# EAGLE design Group_06 (EAGLE 9.6.2)

## Sheet 1 of 2
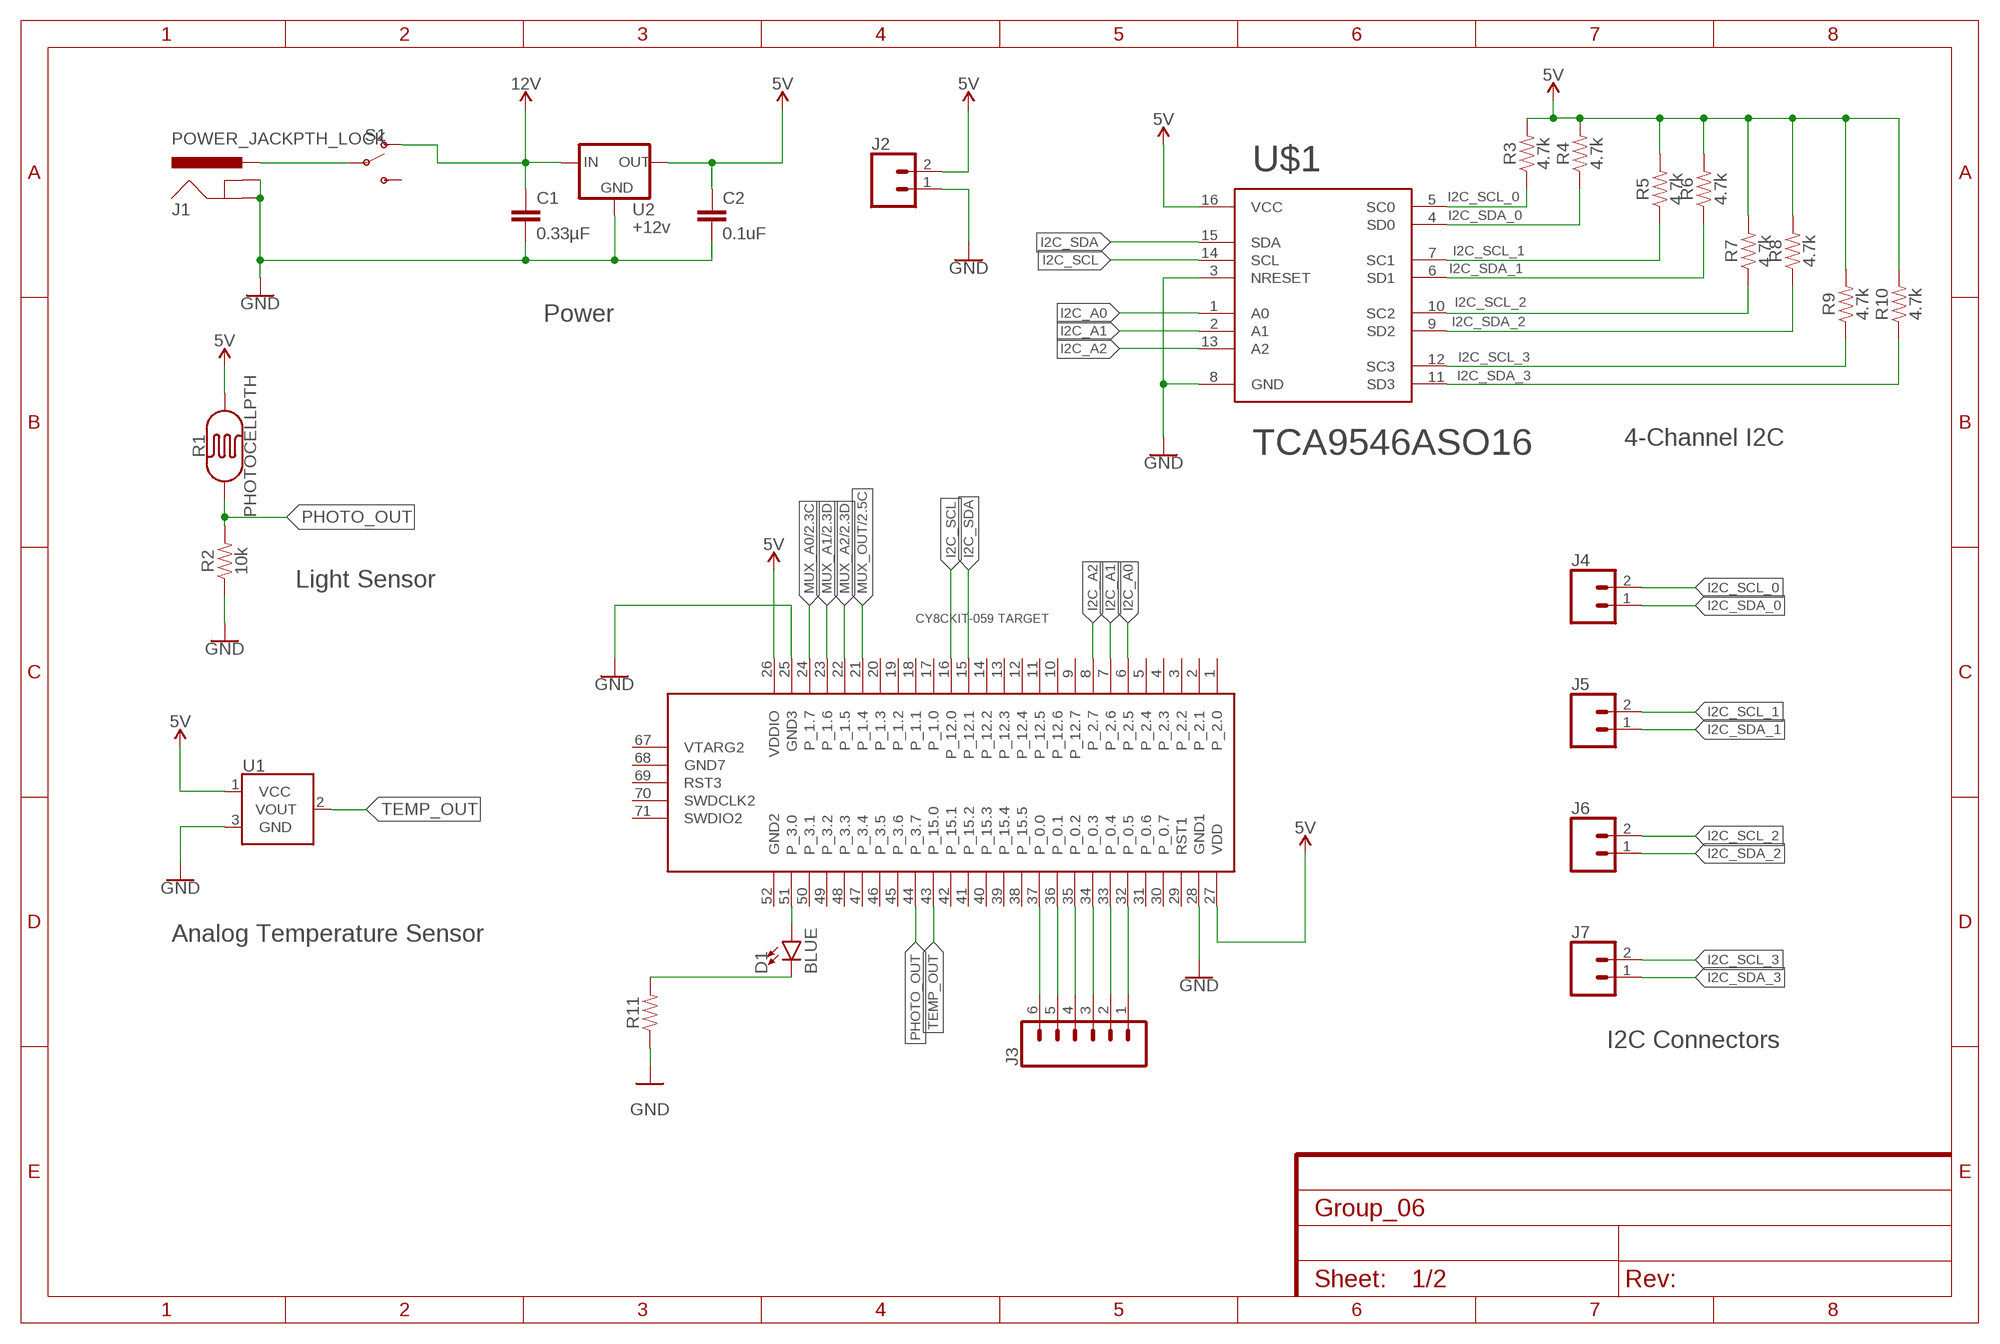
[diagram p0: schematic, sheet 1]

### Parts
C1  0.33µF  0.33UF/330NF-0805-50V-10%  [0805]
C2  0.1uF  0.1UF-KIT-EZ-50V-20%  [CAP-PTH-SMALL-KIT]
D1  BLUE  LED-BLUE1206  [LED-1206]
J1  POWER_JACKPTH_LOCK  [POWER_JACK_PTH_LOCK]
J2  CONN_02  [1X02]
J3  CONN_06LOCK  [1X06_LOCK]
J4  CONN_02  [1X02]
J5  CONN_02  [1X02]
J6  CONN_02  [1X02]
J7  CONN_02  [1X02]
R1  PHOTOCELLPTH  [PHOTOCELL]
R2  10k  10KOHM-0603-1/10W-1%  [0603]
R3  4.7k  4.7KOHM-0603-1/10W-1%  [0603]
R4  4.7k  4.7KOHM-0603-1/10W-1%  [0603]
R5  4.7k  4.7KOHM-0603-1/10W-1%  [0603]
R6  4.7k  4.7KOHM-0603-1/10W-1%  [0603]
R7  4.7k  4.7KOHM-0603-1/10W-1%  [0603]
R8  4.7k  4.7KOHM-0603-1/10W-1%  [0603]
R9  4.7k  4.7KOHM-0603-1/10W-1%  [0603]
R10  4.7k  4.7KOHM-0603-1/10W-1%  [0603]
R11  RESISTORAXIAL-0.3  [AXIAL-0.3]
S1  SWITCH-SPDT-PTH-11.6X4.0MM  [SWITCH_SPDT_PTH_11.6X4.0MM]
U1  TMP36GT9  [TO-92]
U2  +12v  V_REG_78XX7812  [TO-252]
U$1  TCA9546ASO16  [TSSOP-16]
U$2  CY8CKIT-059_TARGET  [CY8CKIT-059_TARGET]

### Nets
5V: C2.1 J2.2 R1.2 R3.2 R4.2 R5.2 R6.2 R7.2 R8.2 R9.2 R10.2 U1.1(VCC) U2.2(OUT) U$1.16(VCC) U$2.26(VDDIO) U$2.27(VDD) ; also sheet 2
12V: C1.1 S1.1(O) U2.1(IN)
GND: C1.2 C2.2 J1.GND J1.GNDBREAK J2.1 R2.1 R11.P$1 U1.3(GND) U2.3(GND) U$1.3(NRESET) U$1.8(GND) U$2.25(GND3) U$2.28(GND1) ; also sheet 2
I2C_A0: U$1.1(A0) U$2.6(P_2.5)
I2C_A1: U$1.2(A1) U$2.7(P_2.6)
I2C_A2: U$1.13(A2) U$2.8(P_2.7)
I2C_SCL: U$1.14(SCL) U$2.16(P_12.0)
I2C_SCL_0: J4.2 R3.1 U$1.5(SC0)
I2C_SCL_1: J5.2 R5.1 U$1.7(SC1)
I2C_SCL_2: J6.2 R7.1 U$1.10(SC2)
I2C_SCL_3: J7.2 R9.1 U$1.12(SC3)
I2C_SDA: U$1.15(SDA) U$2.15(P_12.1)
I2C_SDA_0: J4.1 R4.1 U$1.4(SD0)
I2C_SDA_1: J5.1 R6.1 U$1.6(SD1)
I2C_SDA_2: J6.1 R8.1 U$1.9(SD2)
I2C_SDA_3: J7.1 R10.1 U$1.11(SD3)
MUX_A0: U$2.24(P_1.7) ; also sheet 2
MUX_A1: U$2.23(P_1.6) ; also sheet 2
MUX_A2: U$2.22(P_1.5) ; also sheet 2
MUX_OUT: U$2.21(P_1.4) ; also sheet 2
N$1: J1.PWR S1.2(P)
N$3: D1.A U$2.51(P_3.0)
N$4: D1.C R11.P$2
N$5: J3.6 U$2.37(P_0.0)
N$6: J3.5 U$2.36(P_0.1)
N$7: J3.4 U$2.35(P_0.2)
N$8: J3.3 U$2.34(P_0.3)
N$9: J3.2 U$2.33(P_0.4)
N$18: J3.1 U$2.32(P_0.5)
PHOTO_OUT: R1.1 R2.2 U$2.44(P_3.7)
TEMP_OUT: U1.2(VOUT) U$2.43(P_15.0)
Unconnected: S1.3(S) U$2.1(P_2.0) U$2.2(P_2.1) U$2.3(P_2.2) U$2.4(P_2.3) U$2.5(P_2.4) U$2.9(P_12.7) U$2.10(P_12.6) U$2.11(P_12.5) U$2.12(P_12.4) U$2.13(P_12.3) U$2.14(P_12.2) U$2.17(P_1.0) U$2.18(P_1.1) U$2.19(P_1.2) U$2.20(P_1.3) U$2.29(RST1) U$2.30(P_0.7) U$2.31(P_0.6) U$2.38(P_15.5) U$2.39(P_15.4) U$2.40(P_15.3) U$2.41(P_15.2) U$2.42(P_15.1) U$2.45(P_3.6) U$2.46(P_3.5) U$2.47(P_3.4) U$2.48(P_3.3) U$2.49(P_3.2) U$2.50(P_3.1) U$2.52(GND2) U$2.67(VTARG2) U$2.68(GND7) U$2.69(RST3) U$2.70(SWDCLK2) U$2.71(SWDIO2)

### Notes on the sheet
- Power
- 4-Channel I2C
- Light Sensor
- Analog Temperature Sensor
- I2C Connectors

## Sheet 2 of 2
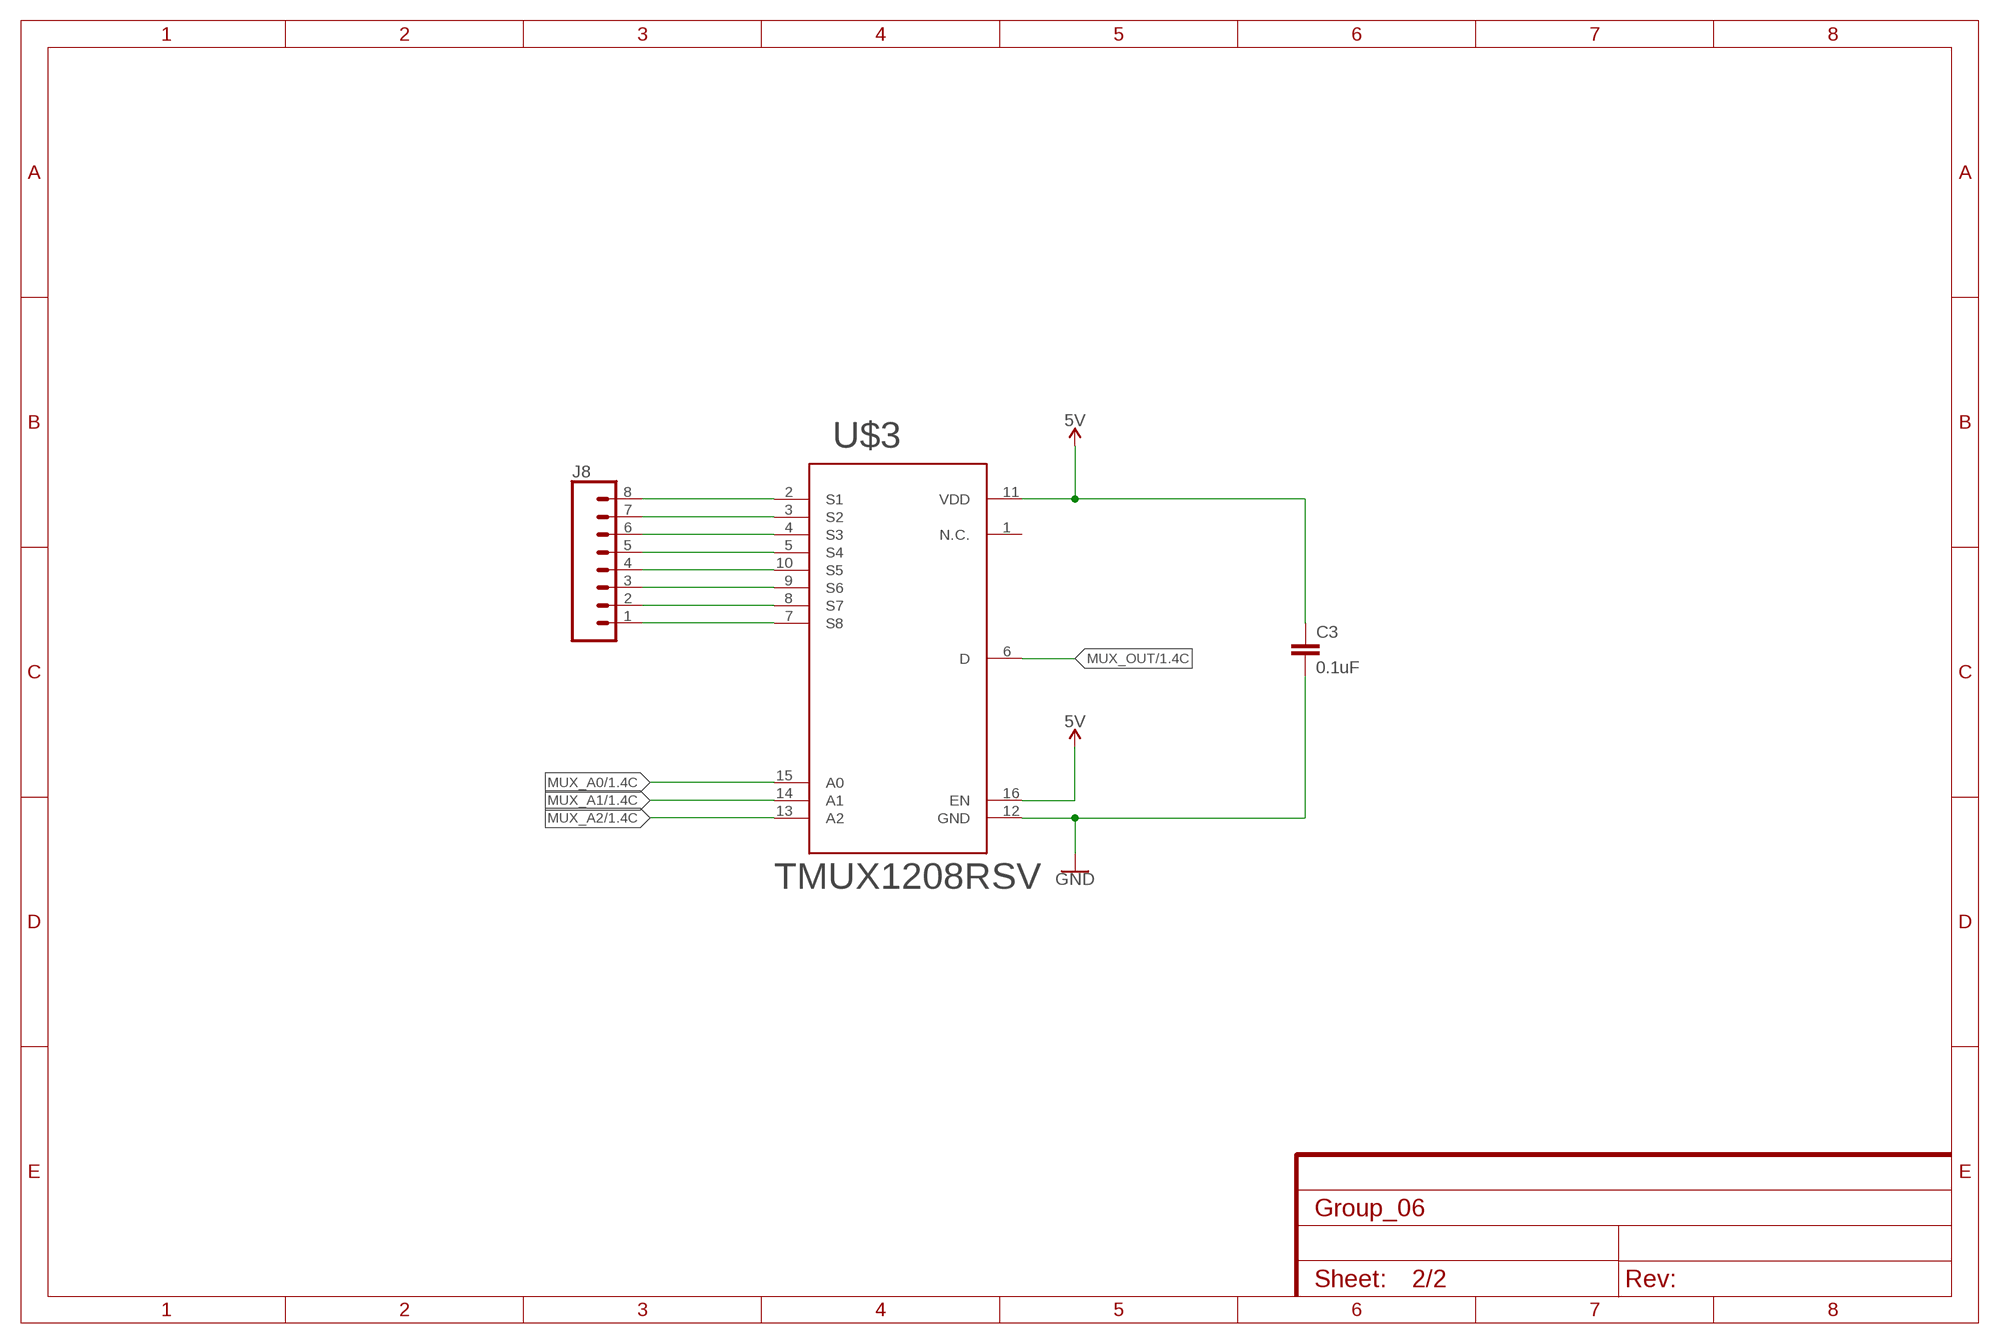
[diagram p1: schematic, sheet 2]

### Parts
C3  0.1uF  0.1UF-KIT-EZ-50V-20%  [CAP-PTH-SMALL-KIT]
J8  CONN_08LOCK  [1X08_LOCK]
U$3  TMUX1208RSV  [QFN-16]

### Nets
5V: C3.1 U$3.11(VDD) U$3.16(EN) ; also sheet 1
GND: C3.2 U$3.12(GND) ; also sheet 1
MUX_A0: U$3.15(A0) ; also sheet 1
MUX_A1: U$3.14(A1) ; also sheet 1
MUX_A2: U$3.13(A2) ; also sheet 1
MUX_OUT: U$3.6(D) ; also sheet 1
N$2: J8.8 U$3.2(S1)
N$10: J8.7 U$3.3(S2)
N$11: J8.6 U$3.4(S3)
N$12: J8.5 U$3.5(S4)
N$13: J8.4 U$3.10(S5)
N$14: J8.3 U$3.9(S6)
N$15: J8.2 U$3.8(S7)
N$16: J8.1 U$3.7(S8)
Unconnected: U$3.1(N.C.)

## Library data of the parts
C1 = SparkFun-Capacitors:0.33UF/330NF: 0.33µF/330nF ceramic capacitors A capacitor is a passive two-terminal electrical component used to store electrical energy temporarily in an electric field.; PROD_ID: CAP-08469
C2 C3 = SparkFun-Capacitors:0.1UF: 0.1µF ceramic capacitors A capacitor is a passive two-terminal electrical component used to store electrical energy temporarily in an electric field.; PROD_ID: CAP-08370
D1 = SparkFun-LED:LED-BLUE: Blue SMD LED Used in manufacturing of various products at SparkFun Packages: 0603 - SMD 0603 package [Product Link] <http://www.digikey.com/product-detail/en/SMLE12BC7TT86/511-1589-2-ND/1641808> 1206 - SMD1206 package [Product Link] <http://www.digikey.com/product-detail/en/lite-on-inc/LTST-C150TBKT/160-1643-1-ND/573584> SparkFun Products: ESP8266 Thing-Dev Board <https://www.sparkfun.com/products/13711> RedBoard <https://www.sparkfun.com/products/12757>; PROD_ID: DIO-09911
J1 = SparkFun-Connectors:POWER_JACK: Power Jack Connector This is the standard 5.5mm barrel jack for power. The PTH is the most common, proven, reliable, footprint. The Slot footprint only works if the mill layer is transmitted to the PCB fab house so be warned. Here are the connectors we sell at SparkFun: DC Barrel Power Jack/Connector <https://www.sparkfun.com/products/119> (PRT-00119) DC Barrel Power Jack/Connector (SMD) <https://www.sparkfun.com/products/12748> (PRT-12748) DC Barrel Jack Adapter - Breadboard Compatible <https://www.sparkfun.com/products/10811> (PRT-10811) It is used on this SparkFun product (and many, many others): SparkFun RedBoard - Programmed with Arduino <https://www.sparkfun.com/products/12757> (DEV-12757) Also, if you need a mating power supply or connector, please check these out: Wall Adapter Power Supply - 9VDC 650mA <https://www.sparkfun.com/products/298> (TOL-00298) DC Barrel Jack Adapter - Male <https://www.sparkfun.com/products/10287> (PRT-10287); PROD_ID: CONN-08197; SF_ID: PRT-00119
J2 J4-J7 = SparkFun-Connectors:CONN_02: Multi connection point. Often used as Generic Header-pin footprint for 0.1 inch spaced/style header connections On any of the 0.1 inch spaced packages, you can populate with these: Break Away Headers - Straight <https://www.sparkfun.com/products/116> (PRT-00116) Break Away Male Headers - Right Angle <https://www.sparkfun.com/products/553> (PRT-00553) Female Headers <https://www.sparkfun.com/products/115> (PRT-00115) Break Away Headers - Machine Pin <https://www.sparkfun.com/products/117> (PRT-00117) Break Away Female Headers - Swiss Machine Pin <https://www.sparkfun.com/products/743> (PRT-00743) For SCREWTERMINALS and SPRING TERMINALS visit here: Screw Terimnals on SparkFun.com <https://www.sparkfun.com/search/results?term=Screw+Terminals> (5mm/3.5mm/2.54mm spacing) This device is also useful as a general connection point to wire up your design to another part of your project. Our various solder wires solder well into these plated through hole pads. Hook-Up Wire - Assortment (Stranded, 22 AWG) <https://www.sparkfun.com/products/11375> (PRT-11375) Hook-Up Wire - Assortment (Solid Core, 22 AWG) <https://www.sparkfun.com/products/11367> (PRT-11367) View the entire wire category on our website here <https://www.sparkfun.com/categories/141> Special notes: Molex polarized connector foot print use with: PRT-08233 with associated crimp pins and housings. 2.54_SCREWTERM for use with PRT-10571. 3.5mm Screw Terminal footprints for PRT-08084 5mm Screw Terminal footprints for use with PRT-08432
J3 = SparkFun-Connectors:CONN_06: Multi connection point. Often used as Generic Header-pin footprint for 0.1 inch spaced/style header connections On any of the 0.1 inch spaced packages, you can populate with these: Break Away Headers - Straight <https://www.sparkfun.com/products/116> (PRT-00116) Break Away Male Headers - Right Angle <https://www.sparkfun.com/products/553> (PRT-00553) Female Headers <https://www.sparkfun.com/products/115> (PRT-00115) Break Away Headers - Machine Pin <https://www.sparkfun.com/products/117> (PRT-00117) Break Away Female Headers - Swiss Machine Pin <https://www.sparkfun.com/products/743> (PRT-00743) Arduino Stackable Header - 6 Pin <https://www.sparkfun.com/products/9280> (PRT-09280) For SCREWTERMINALS and SPRING TERMINALS visit here: Screw Terimnals on SparkFun.com <https://www.sparkfun.com/search/results?term=Screw+Terminals> (5mm/3.5mm/2.54mm spacing) This device is also useful as a general connection point to wire up your design to another part of your project. Our various solder wires solder well into these plated through hole pads. Hook-Up Wire - Assortment (Stranded, 22 AWG) <https://www.sparkfun.com/products/11375> (PRT-11375) Hook-Up Wire - Assortment (Solid Core, 22 AWG) <https://www.sparkfun.com/products/11367> (PRT-11367) View the entire wire category on our website here <https://www.sparkfun.com/categories/141>
J8 = SparkFun-Connectors:CONN_08: Multi connection point. Often used as Generic Header-pin footprint for 0.1 inch spaced/style header connections On any of the 0.1 inch spaced packages, you can populate with these: Break Away Headers - Straight <https://www.sparkfun.com/products/116> (PRT-00116) Break Away Male Headers - Right Angle <https://www.sparkfun.com/products/553> (PRT-00553) Female Headers <https://www.sparkfun.com/products/115> (PRT-00115) Break Away Headers - Machine Pin <https://www.sparkfun.com/products/117> (PRT-00117) Break Away Female Headers - Swiss Machine Pin <https://www.sparkfun.com/products/743> (PRT-00743) Arduino Stackable Header - 8 Pin <https://www.sparkfun.com/products/9279> (PRT-09279) For SCREWTERMINALS and SPRING TERMINALS visit here: Screw Terimnals on SparkFun.com <https://www.sparkfun.com/search/results?term=Screw+Terminals> (5mm/3.5mm/2.54mm spacing) This device is also useful as a general connection point to wire up your design to another part of your project. Our various solder wires solder well into these plated through hole pads. Hook-Up Wire - Assortment (Stranded, 22 AWG) <https://www.sparkfun.com/products/11375> (PRT-11375) Hook-Up Wire - Assortment (Solid Core, 22 AWG) <https://www.sparkfun.com/products/11367> (PRT-11367) View the entire wire category on our website here <https://www.sparkfun.com/categories/141> Special notes: Molex polarized connector foot print use with SKU : PRT-08231 with associated crimp pins and housings. 1MM SMD Version SKU: PRT-10208 NOTES ON THE VARIANTS LOCK and LOCK_LONGPADS... This footprint was designed to help hold the alignment of a through-hole component (i.e. 6-pin header) while soldering it into place. You may notice that each hole has been shifted either up or down by 0.005 of an inch from it's more standard position (which is a perfectly straight line). This slight alteration caused the pins (the squares in the middle) to touch the edges of the holes. Because they are alternating, it causes a "brace" to hold the component in place. 0.005 has proven to be the perfect amount of "off-center" position when using our standard breakaway headers. Although looks a little odd when you look at the bare footprint, once you have a header in there, the alteration is very hard to notice. Also,if you push a header all the way into place, it is covered up entirely on the bottom side.
R1 = SparkFun-Sensors:PHOTOCELL: Photocell (Photodetector, Photo Resistor, CdS) This is a very small light sensor. A photocell changes (also called a photodetector, photo resistor, CdS or photoconductive cell) resistance depending on the amount of light it is exposed to. These little sensors make great ambient light triggers (when light in the room turns on, do something). Datasheet <http://cdn.sparkfun.com/datasheets/Sensors/LightImaging/SEN-09088.pdf> SparkFun Products Mini Photocell <https://www.sparkfun.com/products/9088> (SEN-09088); PROD_ID: COMP-09129; SF_ID: SEN-09088
R2 = SparkFun-Resistors:10KOHM: 10kΩ resistor A resistor is a passive two-terminal electrical component that implements electrical resistance as a circuit element. Resistors act to reduce current flow, and, at the same time, act to lower voltage levels within circuits. - Wikipedia; PROD_ID: RES-00824
R3-R10 = SparkFun-Resistors:4.7KOHM: 4.7kΩ resistor A resistor is a passive two-terminal electrical component that implements electrical resistance as a circuit element. Resistors act to reduce current flow, and, at the same time, act to lower voltage levels within circuits. - Wikipedia; PROD_ID: RES-07857
R11 = SparkFun-Resistors:RESISTOR: Generic Resistor Package
S1 = SparkFun-Switches:SWITCH-SPDT: Single Pole, Double Throw (SPDT) Switch Single-pole, double-throw (SPDT) switch. Variant Overview SMD-AYZ0202 Surface Mount DPDT Switch <https://www.sparkfun.com/products/597> (COM-00597) Used on e.g. LilyPad Arduino USB - ATmega32U4 Board <https://www.sparkfun.com/products/12049> PTH-11.6X4.0MM SPDT Mini Power Switch <https://www.sparkfun.com/products/102> (COM-00102) Used on e.g. SparkFun Simon Says - Through-Hole Soldering Kit <https://www.sparkfun.com/products/10547> (KIT-10547) PTH-11.6X4.0MM-KIT KIT version of SPDT Mini Power Switch - Simplifies soldering by removing tStop of switch pins - only one side can be soldered. PTH-11.6X4.0MM-LOCK LOCK version of SPDT Mini Power Switch - Offset pins hold switch in place for easier soldering. SMD-RIGHT-ANGLE Surface Mount Right Angle Switch <https://www.sparkfun.com/products/10860> (COM-10860) Used on e.g. SparkFun ESP8266 Thing <https://www.sparkfun.com/products/13231>; PROD_ID: SWCH-08261; SF_SKU: COM-00102
U1 = SparkFun-Sensors:TMP36: TMP36 Precision Analog °C Temperature Sensor The TMP36 is a low voltage, precision centigrade temperature sensor. It provides a voltage output that is linearly proportional to the Celsius temperature. It also doesn’t require any external calibration to provide typical accuracies of ±1°C at +25°C and ±2°C over the −40°C to +125°C temperature range. We like it because it’s so easy to use: Just give the device a ground and 2.7 to 5.5 VDC and read the voltage on the Vout pin. The output voltage can be converted to temperature easily using the scale factor of 10 mV/°C. Datasheet <http://cdn.sparkfun.com/datasheets/Sensors/Temp/TMP35_36_37.pdf> SparkFun Products Temperature Sensor - TMP36 <https://www.sparkfun.com/products/10988> (SEN-10988) SparkFun Danger Shield <https://www.sparkfun.com/products/11649> (DEV-11649); PROD_ID: IC-09880; SF_ID: SEN-10988
U2 = SparkFun-IC-Power:V_REG_78XX: Voltage Regulator Standard 78xx regulator. IGO (Input Ground Output). Spark Fun Electronics SKU : COM-00107; PROD_ID: VREG-12370
U$1 = Group_06_Library:TCA9546A: TCA9546A The TCA9546A is a quad bidirectional translating switch controlled via the I2C bus. The SCL/SDA upstream pair fans out to four downstream pairs, or channels. Any individual SCn/SDn channel or combination of channels can be selected, determined by the contents of the programmable control register. An active-low reset (NRESET) input allows the TCA9546A to recover from a situation in which one of the downstream I2C buses is stuck in a low state. Pulling NRESET low resets the I2C state machine and causes all the channels to be deselected, as does the internal power-on reset function. The pass gates of the switches are constructed such that the VCC pin can be used to limit the maximum high voltage, which will be passed by the TCA9546A. Available packages: TSSOP-16
U$2 = CY8KIT-059:CY8CKIT-059_TARGET: CY8CKIT-059 Target This device exposes the pins of the target section of the CY8CKIT-059, including the programming section, that must be connected to the KitProg in order to program the target micro-controller.
U$3 = Group_06_Library:TMUX1208: TMUX1208 The TMUX1208 is general purpose complementary metal-oxide semiconductor (CMOS) multiplexers (MUX). The TMUX1208 offers 8:1 single ended channels. Wide operating supply of 1.08 V to 5.5 V allows for use in a broad array of applications from personal electronics to building automation applications. The device supports bidirectional analog and digital signals on the source (Sx) and drain (D) pins ranging from GND to VDD. Available packages: QFN-16

## Board
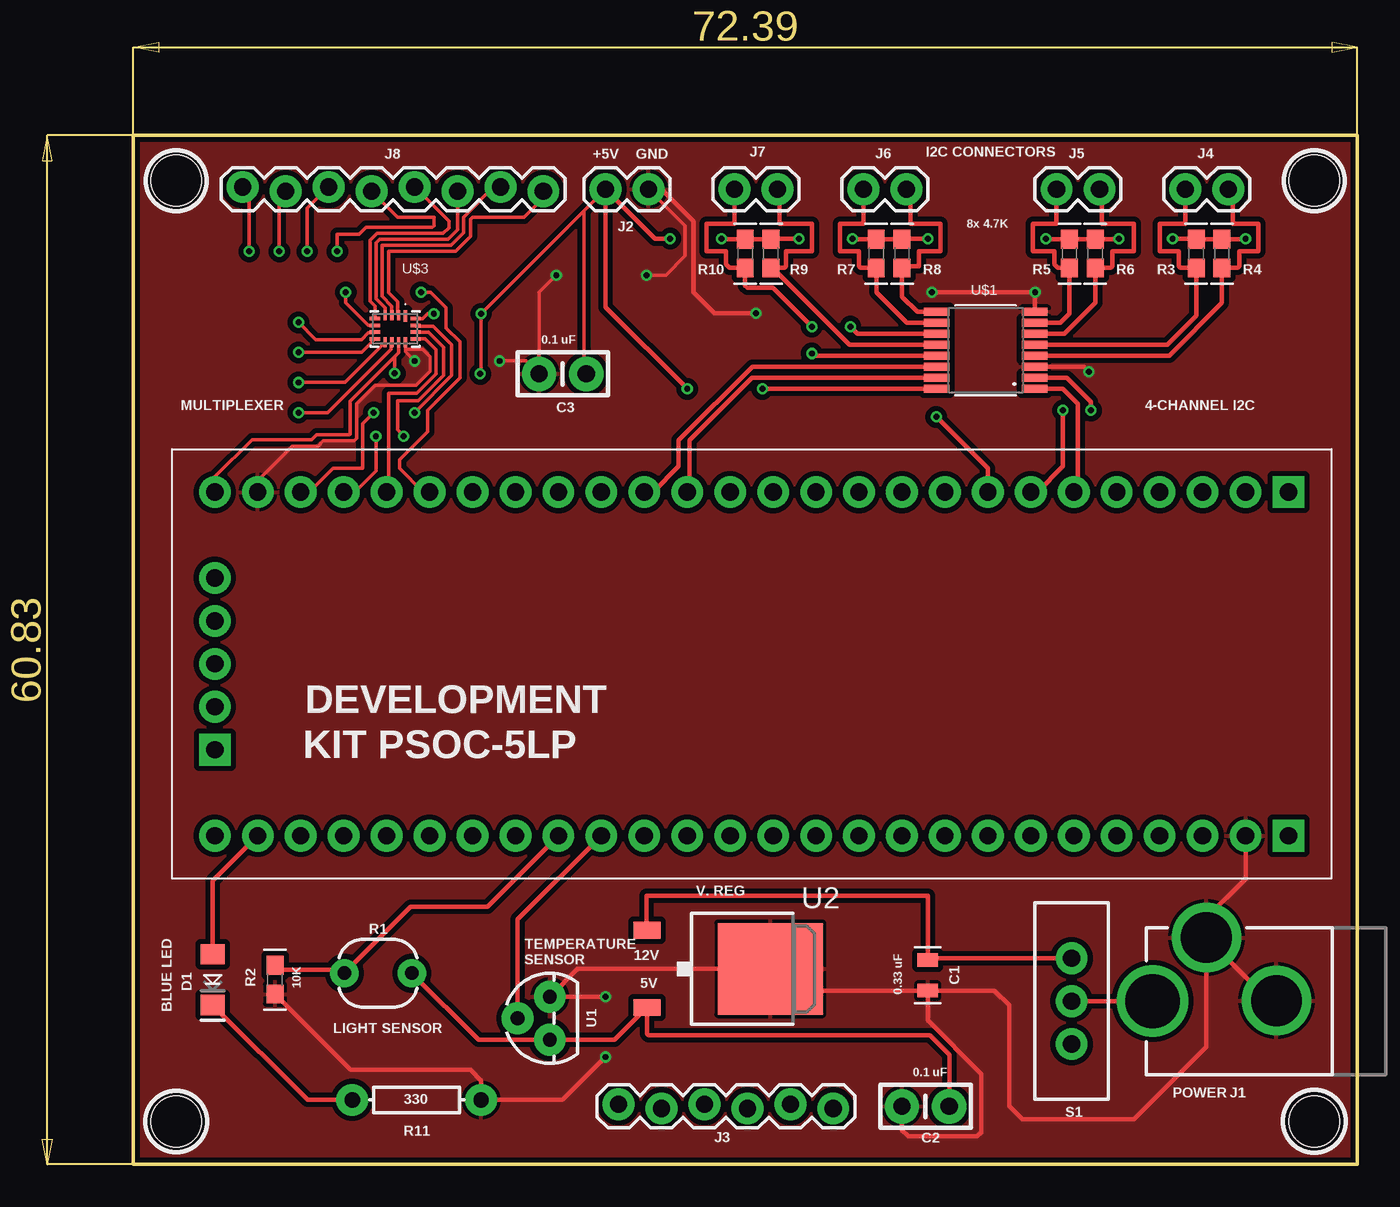
[diagram p2: board, top side]
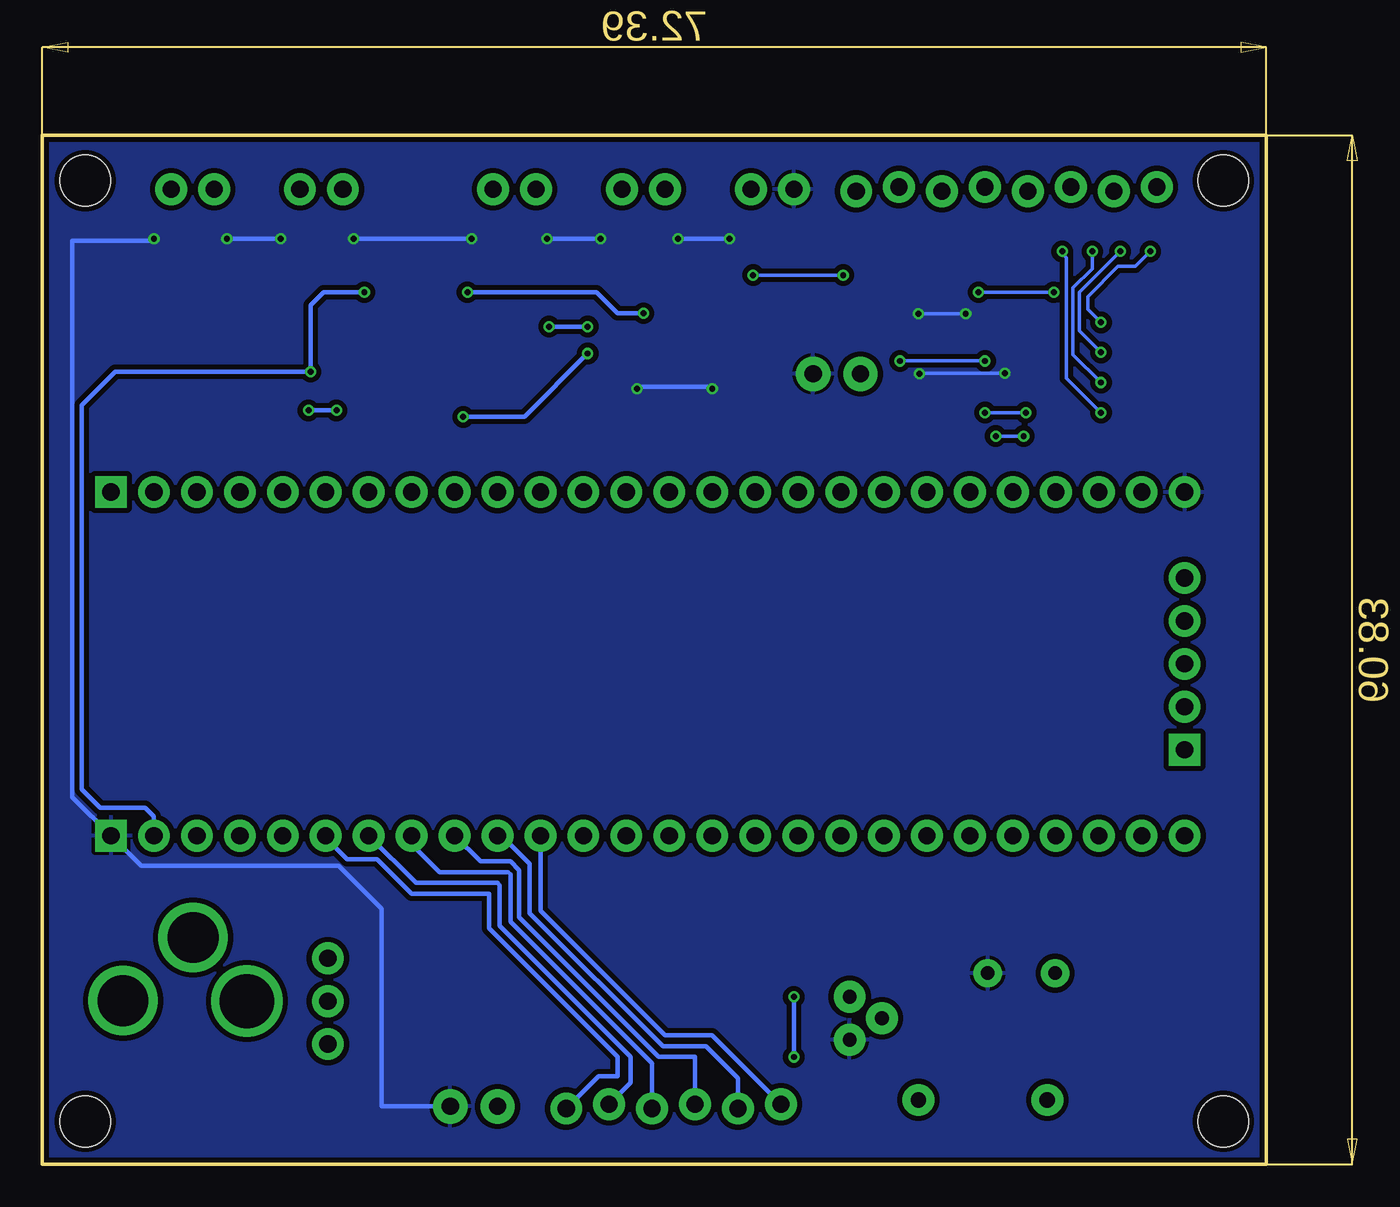
[diagram p3: board, bottom side, seen from below]

Size 72.39 x 60.83 mm. Coordinates in mm from the lower left corner, seen from the top.
Outline: 0,0 0,60.83 72.39,60.83 72.39,0 0,0
Copper layers (1*16): Top 0.035mm / dielectric 1.5mm / Bottom 0.035mm
Design rules "Group_06": minimum track width 6mil, minimum drill 0.2mm, track to track 6mil, track to pad 6mil, pad to pad 6mil, via to via 6mil, smd to smd 6mil, copper to edge 8mil, drill to drill 8mil, minimum pad ring 10mil, minimum via ring 6mil, stop-mask expansion 8mil, vias tented up to drill 0mil, thermal gap 8mil
Holes 3 mm at 2.54,2.54 69.85,58.17 2.54,58.17 69.85,2.54

### Footprints (pad centres in the part's own frame; a part is rotated, then mirrored left to right if it is on the bottom)
0805 = smd 0.8 x 1.2: 1 -0.9,0; 2 0.9,0
CAP-PTH-SMALL-KIT = drill 1.016 pad 2.032: 1 -1.397,0; 2 1.397,0
LED-1206 = smd 1.2 x 1.4: A -1.5,0; C 1.5,0
POWER_JACK_PTH_LOCK = drill 2.997 pad 4.115: GND 0.025,6.557; GNDBREAK 3.762,10.7 | drill 3.2 pad 4.115: PWR 0,13.878
1X02 = drill 1.016 pad 1.88: 1 0,0; 2 2.54,0
1X06_LOCK = drill 1.016 pad 1.88: 1 0,0; 2 2.54,-0.254; 3 5.08,0; 4 7.62,-0.254; 5 10.16,0; 6 12.7,-0.254
1X08_LOCK = drill 1.016 pad 1.88: 1 0,0.127; 2 2.54,-0.127; 3 5.08,0.127; 4 7.62,-0.127; 5 10.16,0.127; 6 12.7,-0.127; 7 15.24,0.127; 8 17.78,-0.127
PHOTOCELL = drill 0.8 pad 1.676: 1 -2,0; 2 2,0
0603 = smd 1.1 x 1: 1 -0.85,0; 2 0.85,0
AXIAL-0.3 = drill 0.9 pad 1.88: P$1 -3.81,0; P$2 3.81,0
SWITCH_SPDT_PTH_11.6X4.0MM = drill 1.016 pad 1.88: 1 0,2.54; 2 0,0; 3 0,-2.54
TO-92 = drill 0.813 pad 1.88: 1 -1.27,0; 2 0,1.905; 3 1.27,0
TO-252 = smd 1 x 1.6: 1 -2.28,-4.8; 2 2.28,-4.8 | smd 5.4 x 6.2: 3 0,2.5
TSSOP-16 = smd 1.5 x 0.45: 1 -2.9,2.275; 2 -2.9,1.625; 3 -2.9,0.975; 4 -2.9,0.325; 5 -2.9,-0.325; 6 -2.9,-0.975; 7 -2.9,-1.625; 8 -2.9,-2.275; 9 2.9,-2.275; 10 2.9,-1.625; 11 2.9,-0.975; 12 2.9,-0.325; 13 2.9,0.325; 14 2.9,0.975; 15 2.9,1.625; 16 2.9,2.275
CY8CKIT-059_TARGET = drill 1.016 pad 1.876 square: 1 30.48,8.89; 27 30.48,-11.43; 71 -33.02,-6.35 | drill 1.016 pad 1.876: 2 27.94,8.89; 3 25.4,8.89; 4 22.86,8.89; 5 20.32,8.89; 6 17.78,8.89; 7 15.24,8.89; 8 12.7,8.89; 9 10.16,8.89; 10 7.62,8.89; 11 5.08,8.89; 12 2.54,8.89; 13 0,8.89; 14 -2.54,8.89; 15 -5.08,8.89; 16 -7.62,8.89; 17 -10.16,8.89; 18 -12.7,8.89; 19 -15.24,8.89; 20 -17.78,8.89; 21 -20.32,8.89; 22 -22.86,8.89; 23 -25.4,8.89; 24 -27.94,8.89; 25 -30.48,8.89; 26 -33.02,8.89; 28 27.94,-11.43; 29 25.4,-11.43; 30 22.86,-11.43; 31 20.32,-11.43; 32 17.78,-11.43; 33 15.24,-11.43; 34 12.7,-11.43; 35 10.16,-11.43; 36 7.62,-11.43; 37 5.08,-11.43; 38 2.54,-11.43; 39 0,-11.43; 40 -2.54,-11.43; 41 -5.08,-11.43; 42 -7.62,-11.43; 43 -10.16,-11.43; 44 -12.7,-11.43; 45 -15.24,-11.43; 46 -17.78,-11.43; 47 -20.32,-11.43; 48 -22.86,-11.43; 49 -25.4,-11.43; 50 -27.94,-11.43; 51 -30.48,-11.43; 52 -33.02,-11.43; 67 -33.02,3.81; 68 -33.02,1.27; 69 -33.02,-1.27; 70 -33.02,-3.81
QFN-16 = smd 0.7 x 0.2: 1 -0.75,0.6 | smd 0.6 x 0.2: 2 -0.8,0.2; 3 -0.8,-0.2; 4 -0.8,-0.6; 9 0.8,-0.6; 10 0.8,-0.2; 11 0.8,0.2; 12 0.8,0.6 | smd 0.2 x 0.6: 5 -0.6,-1.2; 6 -0.2,-1.2; 7 0.2,-1.2; 8 0.6,-1.2; 13 0.6,1.2; 14 0.2,1.2; 15 -0.2,1.2; 16 -0.6,1.2

### Placement (x,y rotation side)
C1  46.99,11.18 270 top
C2  46.86,3.43 180 top
C3  25.4,46.74 180 top
D1  4.7,10.92 270 top
J1  74.17,9.65 90 top
J2  30.48,57.66 180 top
J3  41.4,3.3 180 top
J4  64.77,57.66 180 top
J5  57.15,57.66 180 top
J6  45.72,57.66 180 top
J7  35.56,57.66 0 top
J8  6.48,57.66 0 top
R1  14.48,11.3 0 top
R2  8.38,10.92 90 top
R3  62.87,53.85 90 top
R4  64.39,53.85 90 top
R5  55.37,53.85 90 top
R6  56.9,53.85 90 top
R7  43.94,53.85 90 top
R8  45.47,53.85 90 top
R9  37.72,53.85 90 top
R10  36.2,53.85 90 top
R11  16.76,3.81 180 top
S1  55.5,9.65 0 top
U1  24.64,8.64 90 top
U2  35.18,11.56 270 top
U$1  50.42,48.13 180 top
U$2  37.85,30.86 0 top
U$3  15.49,49.4 270 top

### Tracks (layer width: path | path; a pad name or v marks a point on that pad's centre or on a via)
5V  (via drill 0.35)
  Top 0.203: U$3.16 17.11,50 17.4,50.29 v17.78,50.29 | U$2.26 4.83,40.64 7.03,42.85 10.56,42.85 10.84,43.13 12.78,43.13 12.83,43.18 12.83,45.12 15.47,47.76 | v15.47,46.76 15.47,47.76 | 15.47,47.76 15.69,47.99 U$3.11 | C3.1 26.67,46.86 26.67,56.26 26.61,56.33 | v20.52,46.74 20.57,46.79 v20.57,50.29 26.61,56.33 | J2.2 26.61,56.33
  Top 0.254: R1.2 20.41,7.37 U1.1 28.47,7.37 U2.2 30.38,7.72 30.48,7.62 47.12,7.62 48.26,6.48 C2.1 | U$1.16 37.22,45.86 v37.21,45.85 | v32.77,45.85 27.94,50.67 J2.2 30.86,54.74 v31.75,54.74 | v58.29,54.74 58.25,54.7 R6.2 R5.2 53.98,54.7 v53.98,54.74 | v46.99,54.74 45.51,54.74 R8.2 R7.2 42.58,54.7 v42.55,54.74 | v39.37,54.74 37.76,54.74 R9.2 R10.2 34.84,54.7 v34.8,54.74 | v65.79,54.74 65.75,54.7 R4.2 R3.2 62.83,54.74 v61.47,54.74
  Bottom 0.203: v20.57,50.29 v17.78,50.29 | v20.52,46.74 20.49,46.76 v15.47,46.76
  Bottom 0.254: v37.21,45.85 37.08,45.97 32.89,45.97 v32.77,45.85 | v61.47,54.74 v58.29,54.74 | v42.55,54.74 v39.37,54.74 | v34.8,54.74 v31.75,54.74 | C2.1 52.32,3.43 52.32,15.11 54.86,17.65 66.55,17.65 U$2.27 70.61,21.72 70.61,54.61 65.91,54.61 v65.79,54.74 | v46.99,54.74 v53.98,54.74
  pour Bottom (isolate 0.305): 0,0 0,60.83 72.39,60.83 72.39,0
12V
  Top 0.254: U2.1 30.36,13.85 30.36,15.88 46.99,15.88 C1.1 47.11,12.19 S1.1
GND  (via drill 0.35)
  Top 0.203: 16.09,48.18 U$3.12 | 16.09,48.18 17.13,48.18 17.55,47.75 17.55,46.88 16.72,46.05 14.3,46.05 13.21,44.96 13.21,42.93 13.06,42.77 11.23,42.77 10.92,42.47 9.41,42.47 7.37,40.42 U$2.25 | 16.09,48.18 16.09,48.04 v16.64,47.5 | v21.66,47.5 23.24,47.5 C3.2 24,51.56 v25.02,52.58 | v30.35,52.58 31.5,52.58 32.64,53.72 32.64,55.5 J2.1
  Top 0.254: U$1.3 56.22,47.16 v56.52,46.86 | v47.24,51.56 v53.34,51.56 53.34,50.43 U$1.8 | v36.83,50.32 34.39,50.32 33.15,51.56 33.15,55.75 31.24,57.66 J2.1 | J1.GNDBREAK 63.47,14.57 65.79,16.89 U$2.28 | J1.GNDBREAK 67.2,9.68 J1.GND | J1.GNDBREAK 63.47,6.95 59.18,2.67 52.58,2.67 51.82,3.43 51.82,9.4 50.94,10.28 C1.2 | C1.2 46.99,8.51 50.16,5.33 50.16,1.91 49.91,1.65 45.85,1.65 45.47,2.03 C2.2 | C1.2 38.96,10.28 U2.3 26.29,11.56 U1.3 v27.94,9.91 | R2.1 12.87,5.59 19.94,5.59 20.57,4.95 R11.P$1 25.4,3.81 v27.94,6.35
  Bottom 0.203: v16.64,47.5 v21.66,47.5 | v25.02,52.58 v30.35,52.58
  Bottom 0.254: v53.34,51.56 55.75,51.56 56.52,50.8 v56.52,46.86 68.07,46.86 70.05,44.88 70.05,22.17 68.96,21.08 66.29,21.08 65.79,20.57 U$2.28 | v47.24,51.56 39.6,51.56 38.35,50.32 v36.83,50.32 | v27.94,6.35 v27.94,9.91
  pour Top (isolate 0.305): 0,0 0,60.83 72.39,60.83 72.39,0
I2C_A0
  Top 0.254: U$1.1 54.98,45.86 55.88,44.96 55.88,40.01 U$2.6
I2C_A1  (via drill 0.35)
  Top 0.254: U$1.2 55.22,46.51 56.64,45.09 v56.64,44.58 | v54.99,44.58 54.99,41.27 53.47,39.75 U$2.7
  Bottom 0.254: v56.64,44.58 v54.99,44.58
I2C_A2  (via drill 0.35)
  Top 0.254: U$1.13 40.27,47.81 v40.13,47.94 | U$2.8 50.55,41.15 v47.5,44.2
  Bottom 0.254: v47.5,44.2 43.88,44.2 v40.13,47.94
I2C_SCL
  Top 0.254: U$1.14 36.62,47.16 32.26,42.8 32.26,41.27 30.73,39.75 U$2.16
I2C_SCL_0
  Top 0.254: U$1.5 61.16,48.46 62.87,50.16 R3.1 61.94,53 61.85,53.09 61.85,53.98 60.71,53.98 60.71,55.63 62.23,55.63 J4.2
I2C_SCL_1
  Top 0.254: J5.2 54.61,55.63 53.21,55.63 53.21,53.98 54.48,53.98 54.48,53.21 54.7,53 R5.1 55.37,50.29 54.84,49.76 U$1.7
I2C_SCL_2
  Top 0.254: U$1.10 45.75,49.76 43.94,51.56 R7.1 43.01,53 42.93,53.09 42.93,53.98 41.78,53.98 41.78,55.63 43.18,55.63 J6.2
I2C_SCL_3
  Top 0.254: U$1.12 42.35,48.46 37.81,53 R9.1 38.52,53 38.61,53.09 38.61,53.98 40.13,53.98 40.13,55.63 38.23,55.63 38.23,57.53 J7.2
I2C_SDA
  Top 0.254: U$1.15 36.6,46.51 32.89,42.8 32.89,39.88 U$2.15
I2C_SDA_0
  Top 0.254: U$1.4 61.27,47.81 64.39,50.93 R4.1 65.32,53 65.41,53.09 65.41,53.98 66.55,53.98 66.55,55.63 65.02,55.63 65.02,57.4 J4.1
I2C_SDA_1
  Top 0.254: U$1.6 55.08,49.11 56.9,50.93 R6.1 57.82,53 57.91,53.09 57.91,53.98 59.18,53.98 59.18,55.63 57.28,55.63 57.28,57.53 J5.1
I2C_SDA_2
  Top 0.254: U$1.9 46.37,50.41 45.47,51.31 R8.1 45.55,53.09 46.48,53.09 46.48,53.98 47.75,53.98 47.75,55.63 45.97,55.63 45.97,57.4 J6.1
I2C_SDA_3  (via drill 0.35)
  Top 0.254: v40.13,49.53 37.85,51.82 36.32,51.82 36.2,51.94 R10.1 35.27,53 35.05,53.21 35.05,53.98 33.91,53.98 33.91,55.63 35.56,55.63 J7.1 | U$1.11 42.84,49.11 v42.42,49.53
  Bottom 0.254: v40.13,49.53 v42.42,49.53
MUX_A0  (via drill 0.35)
  Top 0.203: U$3.15 16.74,49.56 17.75,49.56 18.83,48.47 18.83,46.65 v16.64,44.45 | U$2.24 10.41,39.75 11.81,41.15 13.56,41.15 13.56,43.79 v14.22,44.45
  Bottom 0.203: v16.64,44.45 v14.22,44.45
MUX_A1  (via drill 0.35)
  Top 0.203: U$3.14 17.47,49.2 18.35,48.32 18.35,46.67 16.84,45.16 15.62,45.16 15.62,43.43 v16,43.05 | v14.35,43.05 14.35,41.02 13.08,39.75 U$2.23
  Bottom 0.203: v16,43.05 v14.35,43.05
MUX_A2
  Top 0.203: U$2.22 15.11,39.88 15.11,45.59 16.76,45.59 17.91,46.74 17.91,48.15 17.26,48.8 U$3.13
MUX_OUT  (via drill 0.35)
  Top 0.203: U$3.6 13.9,49.6 12.57,50.93 v12.57,51.56 | v17.02,51.56 17.59,51.56 18.51,50.64 18.51,49.44 19.32,48.63 19.32,46.51 17.4,44.59 17.4,43.31 15.75,41.66 15.75,41.15 17.14,39.75 U$2.21
  Bottom 0.203: v12.57,51.56 v17.02,51.56
N$1
  Top 0.254: J1.PWR S1.2
N$2
  Top 0.203: U$3.2 15.65,50.25 15.65,50.99 15.11,51.52 15.11,53.98 19.05,53.98 19.94,54.86 19.94,55.88 20.07,56.01 23.11,56.01 24.26,57.15 J8.8
N$3
  Top 0.254: D1.A 4.7,16.76 U$2.51
N$4
  Top 0.254: D1.C 10.31,3.81 R11.P$2
N$5
  Bottom 0.254: J3.6 32.77,7.62 35.56,7.62 42.93,14.99 U$2.37
N$6
  Bottom 0.254: J3.5 31.24,5.08 33.15,6.99 35.69,6.99 43.56,14.86 43.56,17.78 45.21,19.43 U$2.36
N$7
  Bottom 0.254: J3.4 33.78,6.35 35.94,6.35 44.2,14.61 44.2,17.4 44.7,17.91 46.48,17.91 U$2.35
N$8
  Bottom 0.254: U$2.34 50.55,18.92 48.9,17.27 44.83,17.27 44.7,17.14 44.7,14.35 36.32,5.97 J3.3
N$9
  Bottom 0.254: J3.2 37.59,4.83 37.59,6.35 45.34,14.1 45.34,16.51 45.47,16.64 50.29,16.64 U$2.33
N$10
  Top 0.203: U$3.3 15.29,50.75 14.71,51.33 14.71,54.33 18.8,54.33 19.53,55.07 19.53,56.01 21.31,57.78 J8.7
N$11
  Top 0.203: U$3.4 14.89,50.64 14.36,51.18 14.36,54.48 14.56,54.69 18.62,54.69 19.18,55.24 J8.6
N$12
  Top 0.203: U$3.5 14.29,50.74 14,51.03 14,54.62 14.42,55.04 18.34,55.04 18.67,55.37 18.67,55.75 J8.5
N$13  (via drill 0.35)
  Top 0.203: J8.4 15.62,56.01 17.78,56.01 17.78,55.5 17.68,55.4 13.76,55.4 13.36,54.99 12.06,54.99 v12.06,53.98 | U$3.10 15.25,48.56 15.25,48.2 11.5,44.45 v9.78,44.45
  Bottom 0.203: v9.78,44.45 11.81,46.48 11.81,53.59 12.06,53.85 v12.06,53.98
N$14  (via drill 0.35)
  Top 0.203: J8.3 10.29,56.52 v10.29,53.98 | v9.78,46.23 12.52,46.23 U$3.9
  Bottom 0.203: v10.29,53.98 10.29,52.96 11.43,51.82 11.43,47.88 v9.78,46.23
N$15  (via drill 0.35)
  Top 0.203: J8.2 8.64,57.15 v8.64,53.98 | v9.78,48.01 13.5,48.01 U$3.8
  Bottom 0.203: v8.64,53.98 11.05,51.56 11.05,49.28 v9.78,48.01
N$16  (via drill 0.35)
  Top 0.203: J8.1 6.86,57.4 v6.86,53.98 | v9.78,49.78 10.79,48.77 13.5,48.77 13.89,49.16 14.25,49.16 U$3.7
  Bottom 0.203: v6.86,53.98 7.75,53.09 8.76,53.09 10.54,51.31 10.54,50.55 v9.78,49.78
N$18
  Bottom 0.254: J3.1 39.5,5.21 38.35,5.21 38.35,6.35 45.97,13.97 45.97,16 50.55,16 52.58,18.03 54.36,18.03 55.63,19.3 U$2.32
PHOTO_OUT
  Top 0.254: R2.2 8.64,11.52 12.26,11.52 R1.1 16.41,15.24 20.95,15.24 U$2.44
TEMP_OUT
  Top 0.254: U1.2 22.73,14.48 U$2.43

### Text on the board
tPlace: I2C CONNECTORS | +5V | GND | 8x 4.7K | 0.1 uF | MULTIPLEXER | 4-CHANNEL I2C | DEVELOPMENT | KIT PSOC-5LP | V. REG | TEMPERATURE / SENSOR | 12V | 10K | 5V | 0.33 uF | BLUE LED | LIGHT SENSOR | 0.1 uF | 330 | POWER
tNames: C3 | C2